# EAGLE design Adafruit PAM8302 (EAGLE 6.3)
COMPANY: ADAFRUIT INDUSTRIES; DRAWN: KTOWN; REV: A
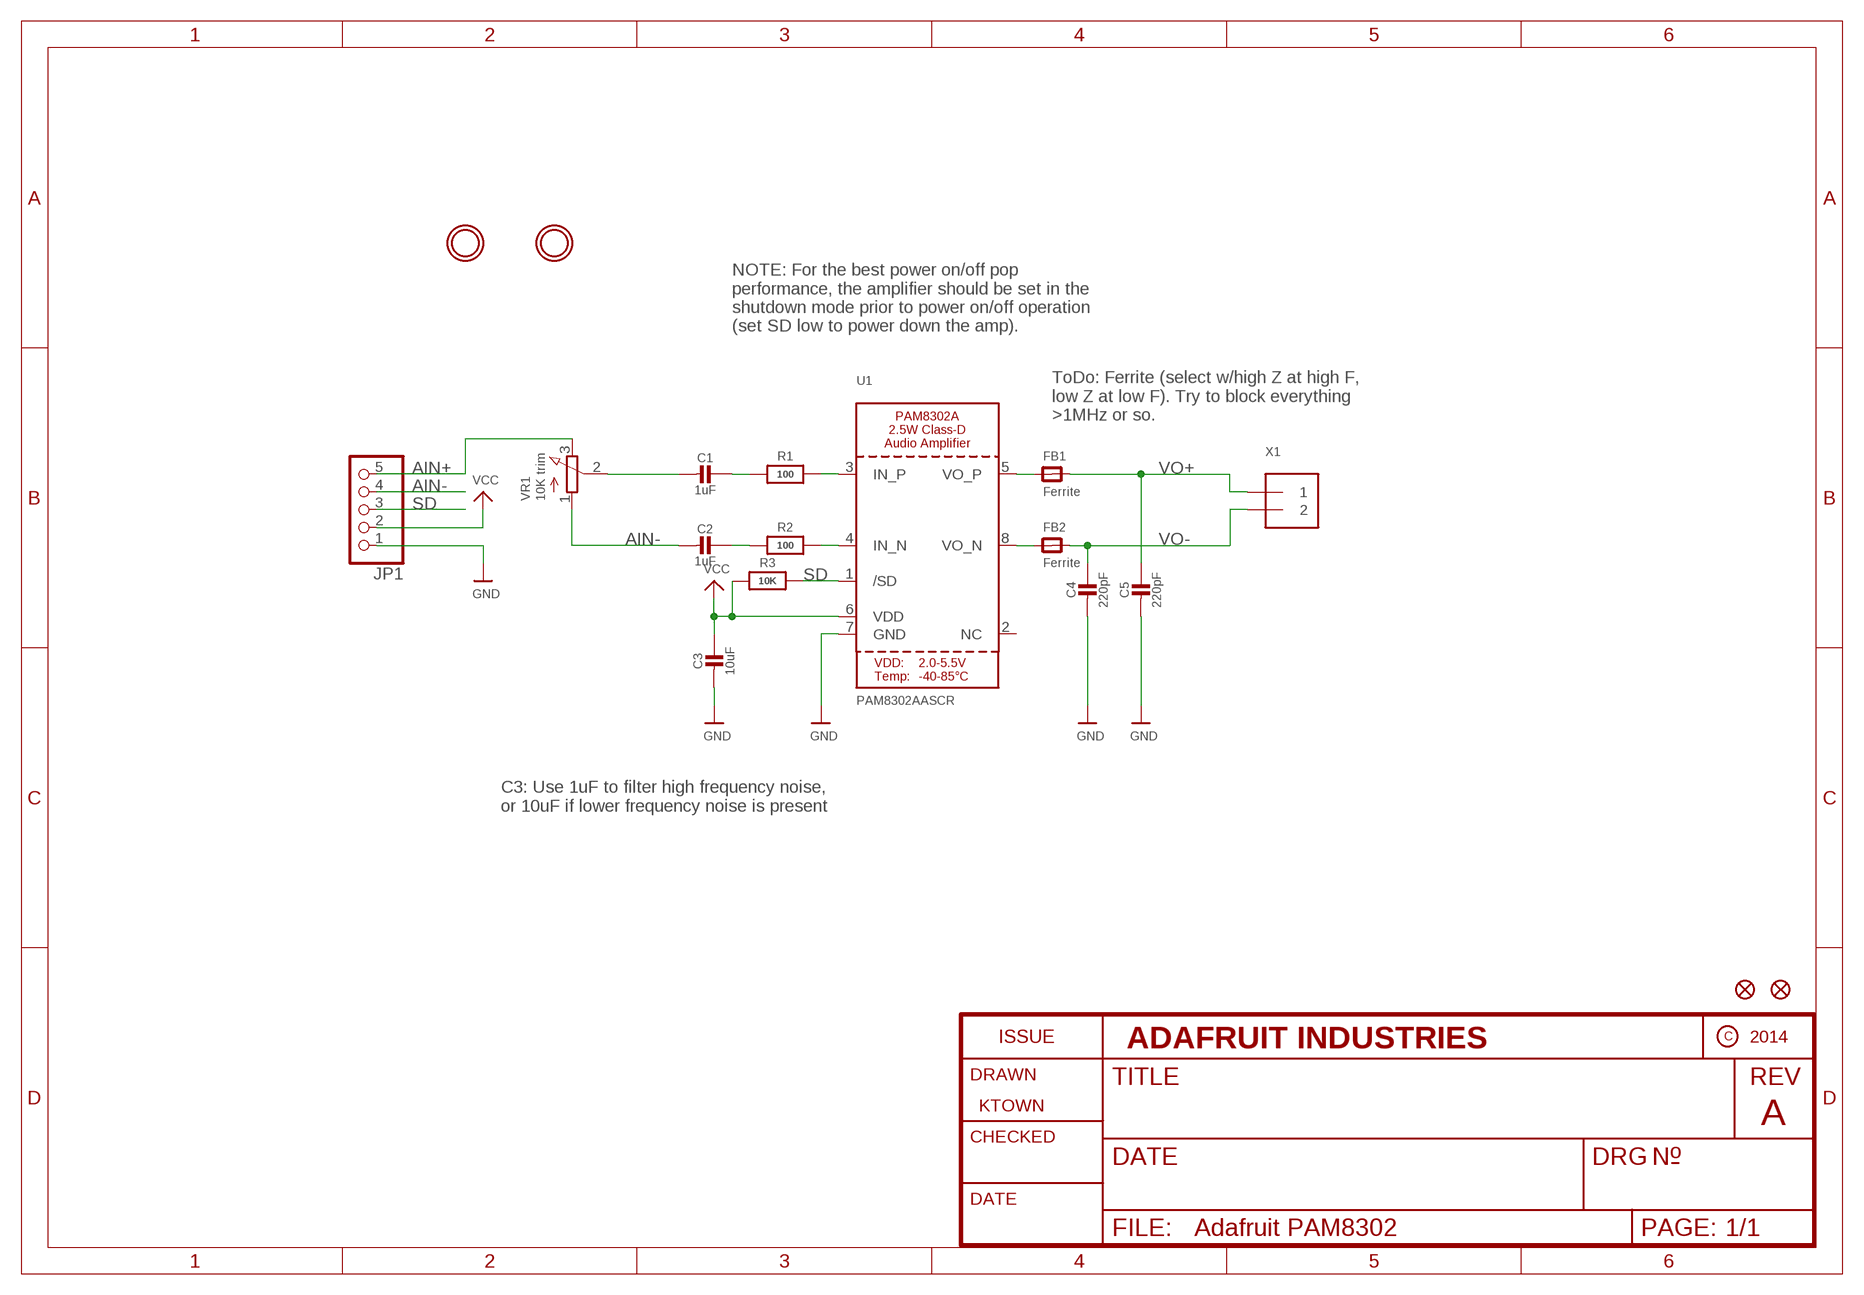
[diagram p0: schematic, sheet 1]

## Parts
C1  1uF  CAP_CERAMIC0805-NOOUTLINE  [0805-NO]
C2  1uF  CAP_CERAMIC0805-NOOUTLINE  [0805-NO]
C3  10uF  CAP_CERAMIC0805-NOOUTLINE  [0805-NO]
C4  220pF  CAP_CERAMIC0805-NOOUTLINE  [0805-NO]
C5  220pF  CAP_CERAMIC0805-NOOUTLINE  [0805-NO]
FB1  Ferrite  FERRITE_0805  [_0805]
FB2  Ferrite  FERRITE_0805  [_0805]
FID1  FIDUCIAL""  [FIDUCIAL_1MM]
FID2  FIDUCIAL""  [FIDUCIAL_1MM]
JP1  HEADER-1X570MIL  [1X05_ROUND_70]
R1  100  RESISTOR0805_NOOUTLINE  [0805-NO]
R2  100  RESISTOR0805_NOOUTLINE  [0805-NO]
R3  10K  RESISTOR0805_NOOUTLINE  [0805-NO]
U1  PAM8302AASCR  AUDIOAMP_PAM8302A  [MSOP8_0.65MM]
U$10  MOUNTINGHOLE2.0  [MOUNTINGHOLE_2.0_PLATED]
U$11  MOUNTINGHOLE2.0  [MOUNTINGHOLE_2.0_PLATED]
VR1  10K trim  TRIMPOT3303W/X  [TRIMPOT_BOURNS_3303W]
X1  TERMBLOCK_1X2  [TERMBLOCK_1X2-3.5MM]

## Nets
AIN+: JP1.5 VR1.3(E)
AIN-: C2.2 JP1.4 VR1.1(A)
GND: C3.2 C4.2 C5.2 JP1.1 U1.7(GND)
N$1: R2.2 U1.4(IN_N)
N$2: R1.2 U1.3(IN_P)
N$3: C1.1 R1.1
N$4: C2.1 R2.1
N$5: FB2.1 U1.8(VO_N)
N$6: FB1.1 U1.5(VO_P)
N$7: C1.2 VR1.2(S)
SD: JP1.3 R3.2 U1.1(/SD)
VCC: C3.1 JP1.2 R3.1 U1.6(VDD)
VO+: C5.1 FB1.2 X1.1
VO-: C4.1 FB2.2 X1.2
Unconnected: U1.2(NC)

## Notes on the sheet
- NOTE: For the best power on/off pop
  performance, the amplifier should be set in the
  shutdown mode prior to power on/off operation
  (set SD low to power down the amp).
- ToDo: Ferrite (select w/high Z at high F,
  low Z at low F). Try to block everything
  >1MHz or so.
- C3: Use 1uF to filter high frequency noise,
  or 10uF if lower frequency noise is present

## Library data of the parts
C1-C5 = microbuilder:CAP_CERAMIC: Ceramic Capacitors For new designs, use the packages preceded by an '_' character since they are more reliable: The following footprints should be used on most boards: _0402 - Standard footprint for regular board layouts _0603 - Standard footprint for regular board layouts _0805 - Standard footprint for regular board layouts _1206 - Standard footprint for regular board layouts For extremely tight-pitch boards where space is at a premium, the following 'micro-pitch' footprints can be used (smaller pads, no silkscreen outline, etc.): _0402MP - Micro-pitch footprint for very dense/compact boards _0603MP - Micro-pitch footprint for very dense/compact boards _0805MP - Micro-pitch footprint for very dense/compact boards _1206MP - Micro-pitch footprint for very dense/compact boards
FB1 FB2 = microbuilder:FERRITE: Ferrite Bead 0603 MMZ1608B121C - 120 Ohm @ 100MHz, 600mA, 0.15 Ohm DC Resistance - Digikey: 445-2164-1-ND BK1608HW121-T - 120 Ohm, 600mA Ferrite Chip - Digikey: 587-1876-2-ND 0805 HZ0805B272R-10 - 2.7K Ohm @ 100MHz, 200mA, 0.8 Ohm DC Resistance - Digikey: 240-2504-1-ND (see also Murata BLM21BD272SN1L) MMZ2012Y152B - 1.5K Ohm @ 100MHz, 500mA, 0.4 Ohm DC Resistance - Digikey: 445-1560-1-ND - Mainly for high frequency (80-400MHz) MMZ2012R102A - 1K Ohm @ 100MHz, 500mA, 0.3 Ohm DC Resistance - Digikey: 445-1555-2-ND - More general purpose (10-200MHz)
FID1 FID2 = microbuilder:FIDUCIAL: Fiducial Alignment Points Various fiducial points for machine vision alignment.; BOM: EXCLUDE
JP1 = microbuilder:HEADER-1X5: PIN HEADER
R1-R3 = microbuilder:RESISTOR: Resistors For new designs, use the packages preceded by an '_' character since they are more reliable: The following footprints should be used on most boards: _0402 - Standard footprint for regular board layouts _0603 - Standard footprint for regular board layouts _0805 - Standard footprint for regular board layouts _1206 - Standard footprint for regular board layouts For extremely tight-pitch boards where space is at a premium, the following 'micro-pitch' footprints can be used (smaller pads, no silkscreen outline, etc.): _0402MP - Micro-pitch footprint for very dense/compact boards _0603MP - Micro-pitch footprint for very dense/compact boards _0805MP - Micro-pitch footprint for very dense/compact boards _1206MP - Micro-pitch footprint for very dense/compact boards
U1 = microbuilder:AUDIOAMP_PAM8302A: PAM8302A - 2.5W Class-D Mono Audio Amplifier MSOP8 = PAM8302AASCR
U$10 U$11 = microbuilder:MOUNTINGHOLE: Mounting Hole For #2 screws (0.086"/2.18mm width, 0.094"/2.4mm hole) use 2.5mm; BOM: EXCLUDE
VR1 = microbuilder:TRIMPOT: 3-Pin SMT Trimpots Bourns TC33 (X-2) Series 1K - Digikey: TC33X-102ECT-ND 10K - Digikey: TC33X-2-103E 100K - Digikey: TC33X-104ECT-ND Bourns 3303 (W) Series 3mm 10K Single Turn - Digikey: 3303W-103ETR-ND 3mm 100K Single Turn - Digikey: 3303X-104ETR-ND
X1 = microbuilder:TERMBLOCK_1X2: 3.5mm Terminal block http://www.ladyada.net/library/pcb/eaglelibrary.html

## Board
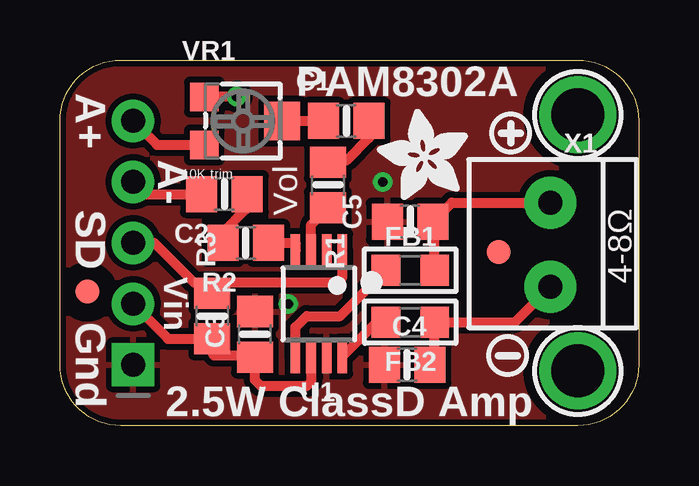
[diagram p1: board, top side]
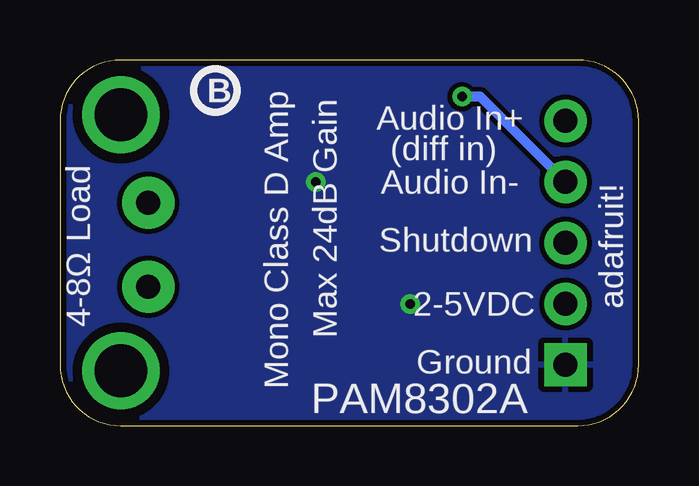
[diagram p2: board, bottom side, seen from below]

Size 24.13 x 15.24 mm. Coordinates in mm from the lower left corner, seen from the top.
Outline: 0,2.54 0,12.7 arc-90 2.54,15.24 21.59,15.24 arc-90 24.13,12.7 24.13,2.54 arc-90 21.59,0 2.54,0 arc-90 0,2.54
Copper layers (1*16): Top 0.035mm / dielectric 1.5mm / Bottom 0.035mm
Design rules "adafruit": minimum track width 8mil, minimum drill 15.5mil, track to track 8mil, track to pad 8mil, pad to pad 8mil, via to via 8mil, smd to smd 8mil, copper to edge 10mil, drill to drill 8mil, minimum pad ring 10mil, minimum via ring 8mil, stop-mask expansion 2mil, vias tented up to drill 20mil, thermal gap 10mil

### Footprints (pad centres in the part's own frame; a part is rotated, then mirrored left to right if it is on the bottom)
0805-NO = smd 1.3 x 1.5: 1 -0.95,0; 2 0.95,0
_0805 = smd 1.2 x 1.3: 1 -1.016,0; 2 1.016,0
FIDUCIAL_1MM = smd 1 x 1: 1 0,0
1X05_ROUND_70 = drill 1 pad 1.778 square: 1 -5.08,0 | drill 1 pad 1.778: 2 -2.54,0; 3 0,0; 4 2.54,0; 5 5.08,0
MSOP8_0.65MM = smd 0.4 x 1.4: 1 -0.975,-2.2; 2 -0.325,-2.2; 3 0.325,-2.2; 4 0.975,-2.2; 5 0.975,2.2; 6 0.325,2.2; 7 -0.325,2.2; 8 -0.975,2.2
MOUNTINGHOLE_2.0_PLATED = drill 2.2 pad 3: P$1 0,0
TRIMPOT_BOURNS_3303W = smd 1.2 x 1.2: 1 -1,-1.6; 3 1,-1.6 | smd 1.6 x 1.5: 2 0,1.65
TERMBLOCK_1X2-3.5MM = drill 1 pad 2.184: 1 1.8,0; 2 -1.7,0

### Placement (x,y rotation side)
C1  11.94,12.7 180 top
C2  6.86,9.65 180 top
C3  8.13,3.81 90 top
C4  14.48,2.54 180 top
C5  14.61,8.51 180 top
FB1  14.61,6.48 0 top
FB2  14.61,4.32 0 top
FID1  18.29,7.24 0 top
FID2  1.14,5.59 0 top
JP1  3.05,7.62 90 top
R1  11.18,10.03 270 top
R2  7.75,7.62 0 top
R3  6.35,4.57 90 top
U1  10.79,5.08 180 top
U$3  [SYMBOL_PLUS]  18.8,12.19 180 top
U$4  [SYMBOL_MINUS]  18.67,2.92 0 top
U$5  [ADAFRUIT_3.5MM]  17.02,9.4 90 top
U$6  [PCBFEAT-REV-040]  17.65,13.97 0 bottom
U$10  21.59,12.95 0 top
U$11  21.59,2.29 0 top
VR1  7.62,12.7 270 top
X1  20.45,7.49 90 top

### Tracks (layer width: path | path; a pad name or v marks a point on that pad's centre or on a via)
AIN+
  Top 0.406: JP1.5 4.05,11.7 VR1.3
AIN-  (via drill 0.4)
  Top 0.406: JP1.4 3.56,9.65 C2.2 | v7.37,13.72 7.48,13.7 VR1.1
  Bottom 0.406: JP1.4 6.6,13.72 v7.37,13.72
GND  (via drill 0.4)
  other vias: 13.46,10.16 9.53,5.08
  pour Top (isolate 0.254): 0,2.54 0,12.7 arc-90 2.54,15.24 21.59,15.24 arc-90 24.13,12.7 24.13,2.54 arc-90 21.59,0 2.54,0 arc-90
  pour Bottom: -0.38,15.37 -0.38,-0.13 24.26,-0.13 24.26,15.37
N$1
  Top 0.406: R2.2 9.82,7.62 U1.4
N$2
  Top 0.406: U1.3 10.47,8.38 R1.2
N$3
  Top 0.406: C1.1 12.89,12 11.94,11.05 11.24,11.05 R1.1
N$4
  Top 0.406: R2.1 6.8,8.07 7.75,9.02 7.75,9.59 C2.1
N$5
  Top 0.406: U1.8 13.21,4.32 FB2.1
N$6
  Top 0.406: U1.5 9.82,4.11 10.29,4.57 11.68,4.57 FB1.1 13.08,5.84
N$7
  Top 0.406: VR1.2 C1.2
SD
  Top 0.406: U1.1 11.77,6.18 11.56,5.97 6.35,5.97 | 6.35,5.97 5.59,5.97 3.94,7.62 JP1.3 | R3.2 6.35,5.97
VCC
  Top 0.406: U1.6 10.47,1.83 10.29,1.65 8.38,1.65 8.13,1.91 C3.1 7.94,2.92 6.41,2.92 R3.1 4.51,3.62 JP1.2
VO+
  Top 0.406: FB1.2 15.62,8.44 C5.1 16.34,9.29 X1.1
VO-
  Top 0.406: C4.1 15.62,2.73 FB2.2 18.97,4.32 X1.2

### Text on the board
tPlace: PAM8302A | A+ | A- | Vol | SD | 4-8Ω | Vin | Gnd | 2.5W ClassD Amp
bPlace: Audio In+ | (diff in) | Audio In- | Max 24dB Gain | Shutdown | Mono Class D Amp | adafruit! | 4-8Ω Load | 2-5VDC | Ground | PAM8302A